# EAGLE schematic Ring (EAGLE 9.6.2)
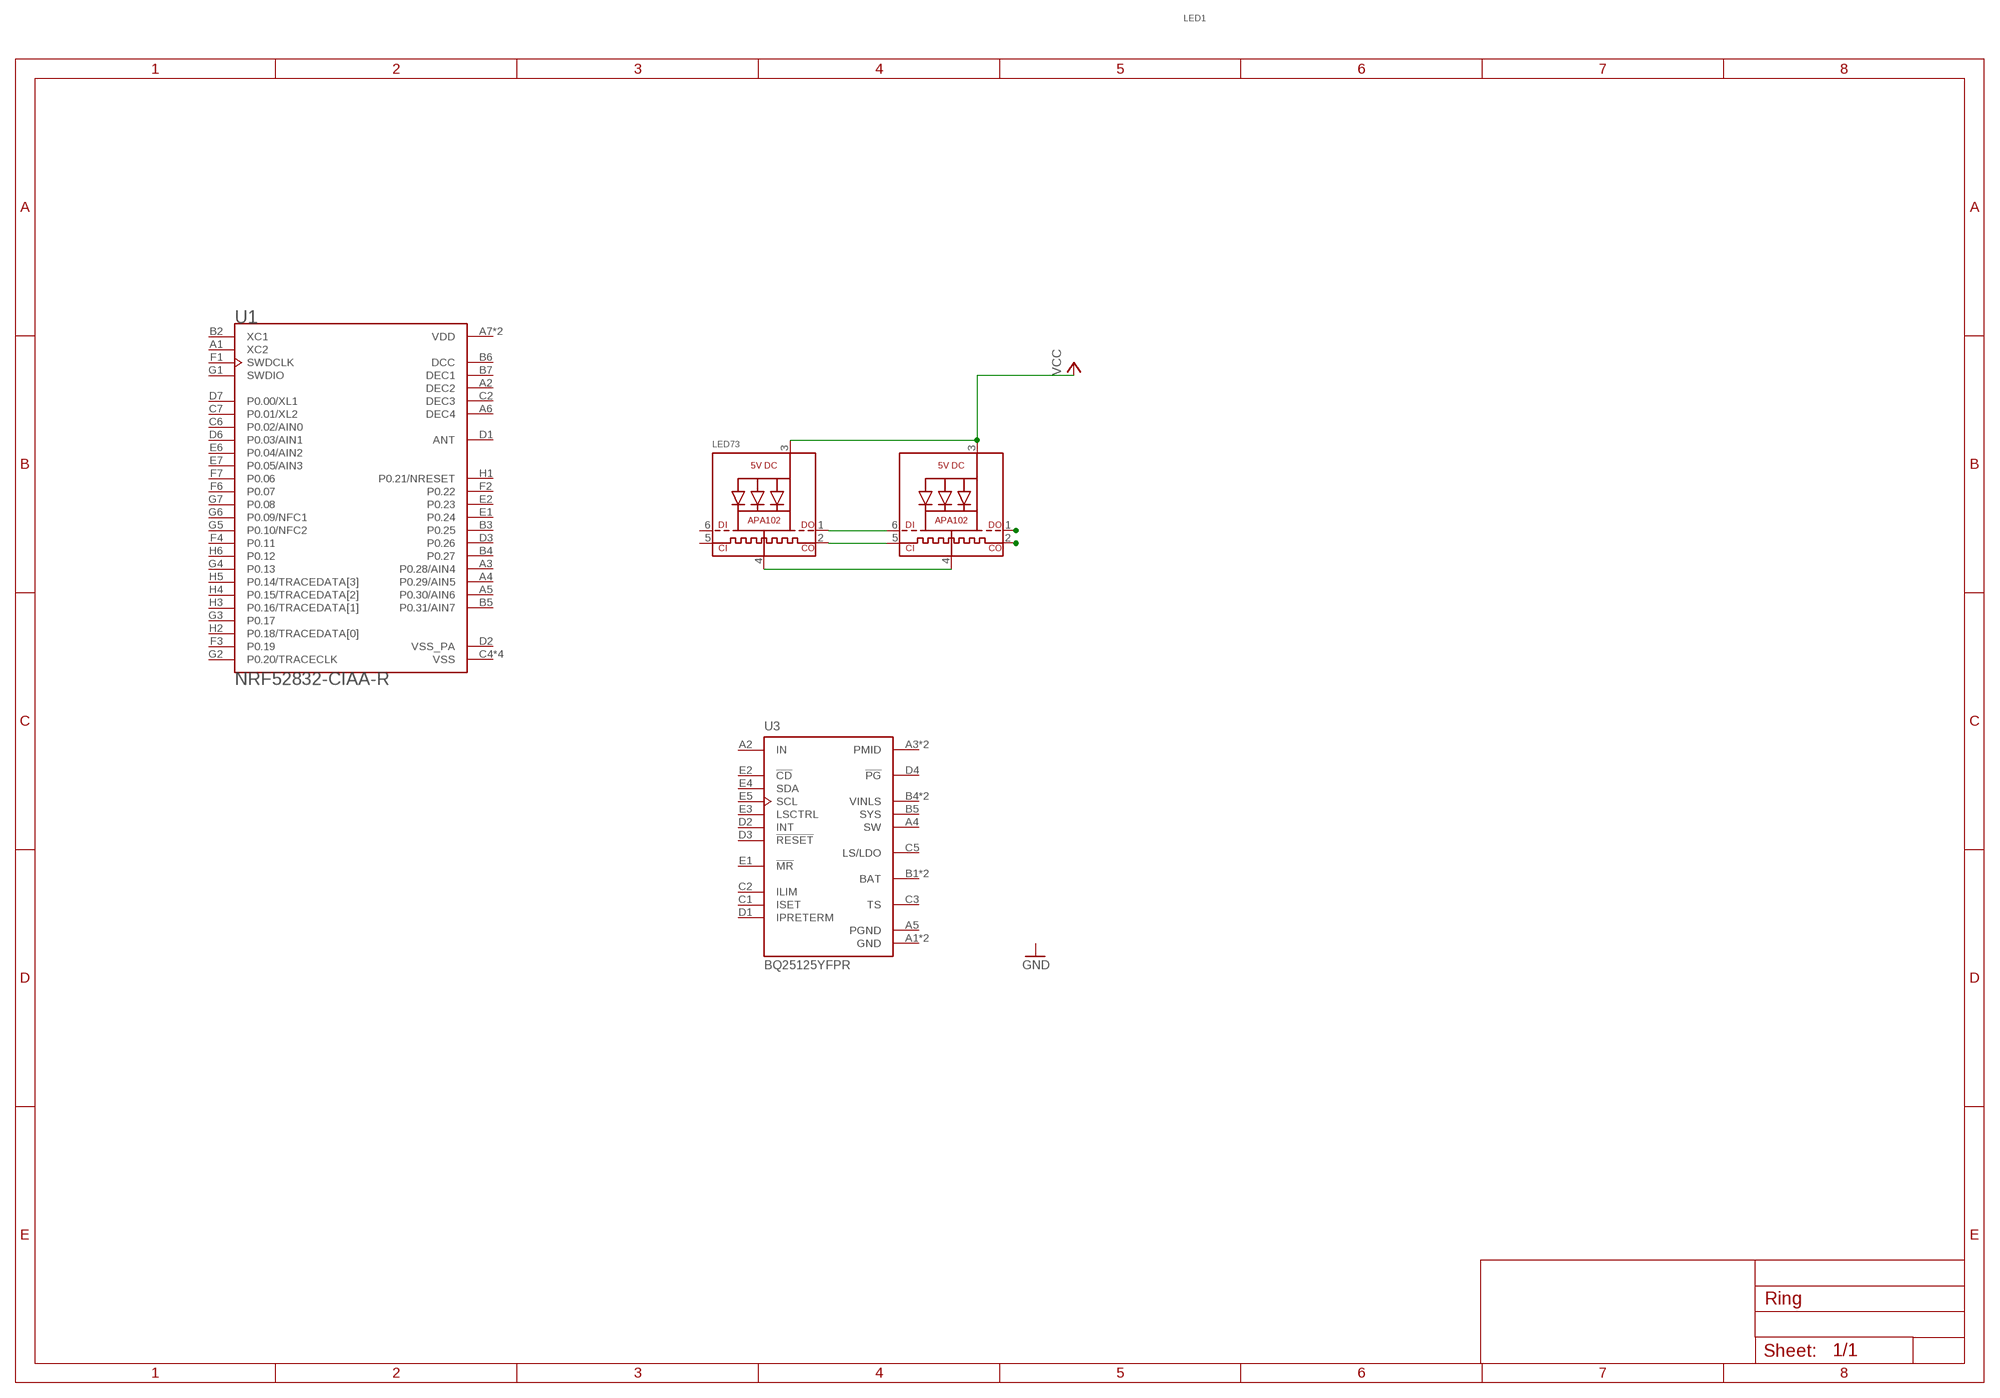
[diagram p0: schematic, sheet 1]

## Parts
LED1  APA1022020  [APA102_2020]
LED73  APA1022020  [APA102_2020]
U1  NRF52832-CIAA-R  [BGA50N40P7X8_300X320X40]
U3  BQ25125YFPR  [BGA25N40P5X5_253X247X50N]

## Nets
GND: LED1.4(GND) LED73.4(GND)
N$1: LED1.1(DO)
N$2: LED1.2(CKO)
N$3: LED1.6(DI) LED73.1(DO)
N$4: LED1.5(CKI) LED73.2(CKO)
VCC: LED1.3(VDD) LED73.3(VDD)
Unconnected: LED73.5(CKI) LED73.6(DI) U1.A1(XC2) U1.A3(P0.28/AIN4) U1.A4(P0.29/AIN5) U1.A5(P0.30/AIN6) U1.B2(XC1) U1.B3(P0.25) U1.B4(P0.27) U1.B5(P0.31/AIN7) U1.C6(P0.02/AIN0) U1.C7(P0.01/XL2) U1.D1(ANT) U1.D3(P0.26) U1.D6(P0.03/AIN1) U1.D7(P0.00/XL1) U1.E1(P0.24) U1.E2(P0.23) U1.E6(P0.04/AIN2) U1.E7(P0.05/AIN3) U1.F1(SWDCLK) U1.F2(P0.22) U1.F3(P0.19) U1.F4(P0.11) U1.F6(P0.07) U1.F7(P0.06) U1.G1(SWDIO) U1.G2(P0.20/TRACECLK) U1.G3(P0.17) U1.G4(P0.13) U1.G5(P0.10/NFC2) U1.G6(P0.09/NFC1) U1.G7(P0.08) U1.H1(P0.21/NRESET) U1.H2(P0.18/TRACEDATA[0]) U1.H3(P0.16/TRACEDATA[1]) U1.H4(P0.15/TRACEDATA[2]) U1.H5(P0.14/TRACEDATA[3]) U1.H6(P0.12) U3.A2(IN) U3.A3(PMID) U3.A4(SW) U3.B1(BAT) U3.B2(BAT) U3.B3(PMID) U3.B4(VINLS) U3.B5(SYS) U3.C1(ISET) U3.C2(ILIM) U3.C3(TS) U3.C4(VINLS) U3.C5(LS/LDO) U3.D1(IPRETERM) U3.D2(INT) U3.D3(!RESET) U3.D4(!PG) U3.E1(!MR) U3.E2(!CD) U3.E3(LSCTRL) U3.E4(SDA) U3.E5(SCL)

## Power pins joined to a net without a drawn wire
DCC: U1.B6(DCC)
DEC1: U1.B7(DEC1)
DEC2: U1.A2(DEC2)
DEC3: U1.C2(DEC3)
DEC4: U1.A6(DEC4)
GND: U3.A1(GND) U3.D5(GND)
PGND: U3.A5(PGND)
VDD: U1.A7(VDD) U1.H7(VDD)
VSS: U1.C4(VSS) U1.C5(VSS) U1.E3(VSS) U1.F5(VSS)
VSS_PA: U1.D2(VSS_PA)

## Library data of the parts
LED1 LED73 = microbuilder:APA102: APA102/DotStar Pixels VCC: 5V DC Refresh Rate: 400Hz
U1 = NRF52832-CIAA-R:NRF52832-CIAA-R: Multi Protocal Bluetooth Smart ANT 2.4GHz RF SoC (WL-CSP) Check availability <https://pricing.snapeda.com/parts/NRF52832-CIAA-R/Nordic/view-part?ref=eda>; AVAILABILITY: In Stock; DESCRIPTION: IC RF TxRx + MCU General ISM > 1GHz ANT, Bluetooth v5.0 2.4GHz 50-XFBGA, WLCSP; MF: Nordic; MP: NRF52832-CIAA-R; PACKAGE: XFBGA-50 Nordic Semiconductor; PRICE: None; PURCHASE-URL: https://pricing.snapeda.com/search/part/NRF52832-CIAA-R/?ref=eda
U3 = BQ25125YFPR:BQ25125YFPR: Low IQ highly integrated battery charge management solution for wearables and IoT 25-DSBGA -40 to 85 Check availability <https://pricing.snapeda.com/parts/BQ25125YFPR/Texas%20Instruments/view-part?ref=eda>; AVAILABILITY: In Stock; DESCRIPTION: Low IQ highly integrated battery charge management solution for wearables and IoT; MF: Texas Instruments; MP: BQ25125YFPR; PACKAGE: DSBGA-25 Texas Instruments; PRICE: None; PURCHASE-URL: https://pricing.snapeda.com/search/part/BQ25125YFPR/?ref=eda